# EAGLE schematic NewMUM (EAGLE 6.5.0)
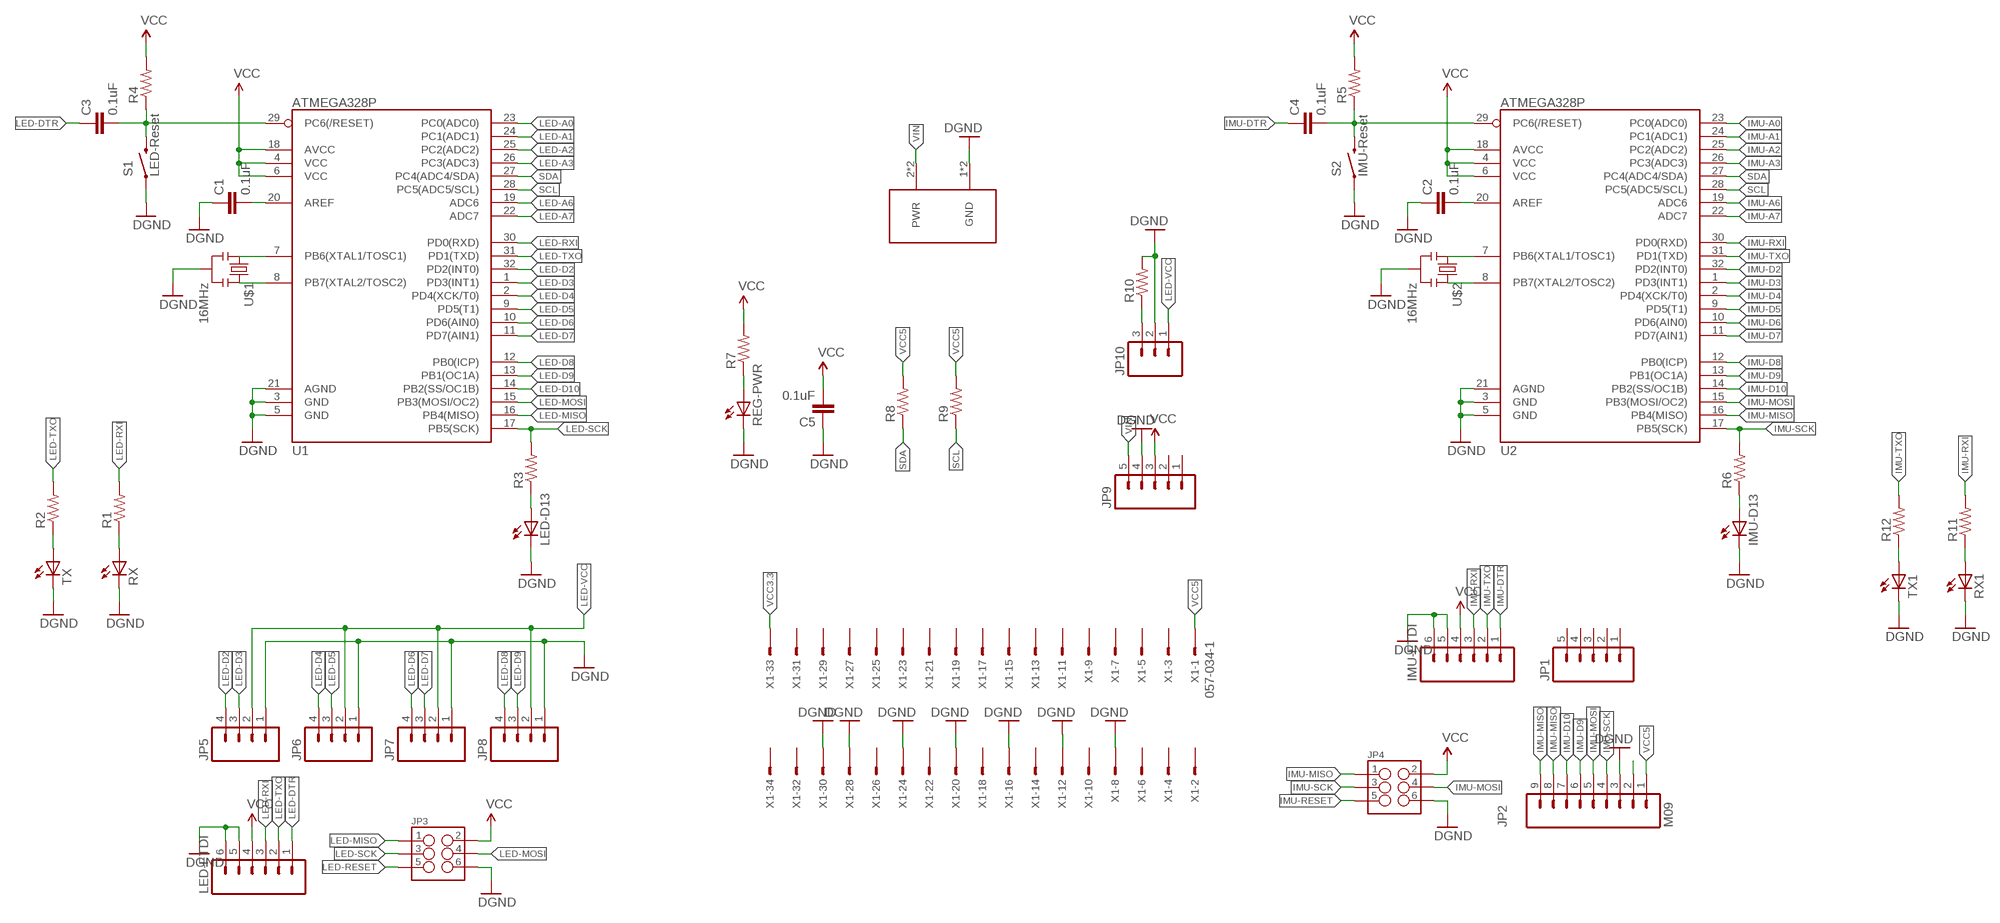
[diagram p0: schematic, sheet 1]

## Parts
C1  0.1uF  CAP0805  [0805]
C2  0.1uF  CAP0805  [0805]
C3  0.1uF  CAP0805  [0805]
C4  0.1uF  CAP0805  [0805]
C5  0.1uF  CAP0805  [0805]
IMU-D13  LED1206  [LED-1206]
IMU-FTDI  M06SIP  [1X06]
JP1  M05PTH  [1X05]
JP2  M09  [1X09]
JP3  M03X22X3_SILK_SM  [2X3]
JP4  M03X22X3_SILK_SM  [2X3]
JP5  M04PTH  [1X04]
JP6  M04PTH  [1X04]
JP7  M04PTH  [1X04]
JP8  M04PTH  [1X04]
JP9  M05PTH  [1X05]
JP10  M03PTH  [1X03]
LED-D13  LED1206  [LED-1206]
LED-FTDI  M06SIP  [1X06]
R1  RESISTOR0805-RES  [0805]
R2  RESISTOR0805-RES  [0805]
R3  RESISTOR0805-RES  [0805]
R4  RESISTOR0805-RES  [0805]
R5  RESISTOR0805-RES  [0805]
R6  RESISTOR0805-RES  [0805]
R7  RESISTOR0805-RES  [0805]
R8  RESISTOR0805-RES  [0805]
R9  RESISTOR0805-RES  [0805]
R10  RESISTOR0805-RES  [0805]
R11  RESISTOR0805-RES  [0805]
R12  RESISTOR0805-RES  [0805]
REG-PWR  LED1206  [LED-1206]
RX  LED1206  [LED-1206]
RX1  LED1206  [LED-1206]
S1  LED-Reset  SWITCH-MOMENTARY-2PTH  [TACTILE-PTH]
S2  IMU-Reset  SWITCH-MOMENTARY-2PTH  [TACTILE-PTH]
TX  LED1206  [LED-1206]
TX1  LED1206  [LED-1206]
U1  ATMEGA328P  ATMEGA328_SMT  [TQFP32-08]
U2  ATMEGA328P  ATMEGA328_SMT  [TQFP32-08]
U$1  16MHz  RESONATOR-WIDE  [RESONATOR-WIDE-SMD]
U$2  16MHz  RESONATOR-WIDE  [RESONATOR-WIDE-SMD]
U$3  LSF-SMT  [LSF-SMT]
X1  057-034-1  [057-034-1]

## Nets
GND: C1.1 C2.1 C5.1 IMU-D13.C IMU-FTDI.5 IMU-FTDI.6 JP2.3 JP3.6 JP4.6 JP5.1 JP6.1 JP7.1 JP8.1 JP9.4 JP10.2 LED-D13.C LED-FTDI.5 LED-FTDI.6 R10.2 REG-PWR.C RX1.C RX.C S1.1 S2.1 TX1.C TX.C U1.3(GND) U1.5(GND) U1.21(AGND) U2.3(GND) U2.5(GND) U2.21(AGND) U$1.2 U$2.2 U$3.1(GND) U$3.1-2(GND) X1.8 X1.12 X1.16 X1.20 X1.24 X1.28 X1.30 ; supply symbol labelled DGND
IMU-A0: U2.23(PC0(ADC0))
IMU-A1: U2.24(PC1(ADC1))
IMU-A2: U2.25(PC2(ADC2))
IMU-A3: U2.26(PC3(ADC3))
IMU-A6: U2.19(ADC6)
IMU-A7: U2.22(ADC7)
IMU-D2: U2.32(PD2(INT0))
IMU-D3: U2.1(PD3(INT1))
IMU-D4: U2.2(PD4(XCK/T0))
IMU-D5: U2.9(PD5(T1))
IMU-D6: U2.10(PD6(AIN0))
IMU-D7: U2.11(PD7(AIN1))
IMU-D8: U2.12(PB0(ICP))
IMU-D9: JP2.6 U2.13(PB1(OC1A))
IMU-D10: JP2.7 U2.14(PB2(SS/OC1B))
IMU-DTR: C4.1 IMU-FTDI.1
IMU-MISO: JP2.8 JP2.9 JP4.1 U2.16(PB4(MISO))
IMU-MOSI: JP2.5 JP4.4 U2.15(PB3(MOSI/OC2))
IMU-RESET: C4.2 JP4.5 R5.1 S2.3 U2.29(PC6(/RESET))
IMU-RXI: IMU-FTDI.3 R11.2 U2.30(PD0(RXD))
IMU-SCK: JP2.4 JP4.3 R6.2 U2.17(PB5(SCK))
IMU-TXO: IMU-FTDI.2 R12.2 U2.31(PD1(TXD))
LED-A0: U1.23(PC0(ADC0))
LED-A1: U1.24(PC1(ADC1))
LED-A2: U1.25(PC2(ADC2))
LED-A3: U1.26(PC3(ADC3))
LED-A6: U1.19(ADC6)
LED-A7: U1.22(ADC7)
LED-D2: JP5.4 U1.32(PD2(INT0))
LED-D3: JP5.3 U1.1(PD3(INT1))
LED-D4: JP6.4 U1.2(PD4(XCK/T0))
LED-D5: JP6.3 U1.9(PD5(T1))
LED-D6: JP7.4 U1.10(PD6(AIN0))
LED-D7: JP7.3 U1.11(PD7(AIN1))
LED-D8: JP8.4 U1.12(PB0(ICP))
LED-D9: JP8.3 U1.13(PB1(OC1A))
LED-D10: U1.14(PB2(SS/OC1B))
LED-DTR: C3.1 LED-FTDI.1
LED-MISO: JP3.1 U1.16(PB4(MISO))
LED-MOSI: JP3.4 U1.15(PB3(MOSI/OC2))
LED-RESET: C3.2 JP3.5 R4.1 S1.3 U1.29(PC6(/RESET))
LED-RXI: LED-FTDI.3 R1.2 U1.30(PD0(RXD))
LED-SCK: JP3.3 R3.2 U1.17(PB5(SCK))
LED-TXO: LED-FTDI.2 R2.2 U1.31(PD1(TXD))
LED-VCC: JP5.2 JP6.2 JP7.2 JP8.2 JP10.1
N$1: U2.8(PB7(XTAL2/TOSC2)) U$2.3
N$2: U2.7(PB6(XTAL1/TOSC1)) U$2.1
N$3: U1.8(PB7(XTAL2/TOSC2)) U$1.3
N$4: U1.7(PB6(XTAL1/TOSC1)) U$1.1
N$5: R1.1 RX.A
N$6: C1.2 U1.20(AREF)
N$7: C2.2 U2.20(AREF)
N$8: R2.1 TX.A
N$9: LED-D13.A R3.1
N$10: R11.1 RX1.A
N$11: IMU-D13.A R6.1
N$12: R12.1 TX1.A
N$13: JP2.2
N$14: R7.1 REG-PWR.A
N$17: JP10.3 R10.1
SCL: R9.1 U1.28(PC5(ADC5/SCL)) U2.28(PC5(ADC5/SCL))
SDA: R8.1 U1.27(PC4(ADC4/SDA)) U2.27(PC4(ADC4/SDA))
VCC: C5.2 IMU-FTDI.4 JP3.2 JP4.2 JP9.3 LED-FTDI.4 R4.2 R5.2 R7.2 U1.4(VCC) U1.6(VCC) U1.18(AVCC) U2.4(VCC) U2.6(VCC) U2.18(AVCC)
VCC3.3: X1.33
VCC5: JP2.1 R8.2 R9.2 X1.1
VIN: JP9.5 U$3.2(PWR) U$3.2-2(PWR)
Unconnected: JP1.1 JP1.2 JP1.3 JP1.4 JP1.5 JP9.1 JP9.2 X1.2 X1.3 X1.4 X1.5 X1.6 X1.7 X1.9 X1.10 X1.11 X1.13 X1.14 X1.15 X1.17 X1.18 X1.19 X1.21 X1.22 X1.23 X1.25 X1.26 X1.27 X1.29 X1.31 X1.32 X1.34

## Library data of the parts
C1-C5 = SparkFun-Capacitors:CAP: Capacitor Standard 0603 ceramic capacitor, and 0.1" leaded capacitor.
IMU-D13 LED-D13 REG-PWR RX RX1 TX TX1 = LilyPad-Wearables:LED: LEDs Standard schematic elements and footprints for 5mm, 3mm, 1206, and 0603 sized LEDs. 5mm - Spark Fun Electronics SKU : Comp-SBL
IMU-FTDI LED-FTDI = SparkFun-Connectors:M06: Header 6 Standard 6-pin 0.1" header. Use with straight break away headers (SKU : PRT-00116), right angle break away headers (PRT-00553), swiss pins (PRT-00743), machine pins (PRT-00117), and female headers (PRT-00115). Molex polarized connector foot print use with SKU : PRT-08094 with associated crimp pins and housings. NOTES ON THE VARIANTS LOCK and LOCK_LONGPADS... This footprint was designed to help hold the alignment of a through-hole component (i.e. 6-pin header) while soldering it into place. You may notice that each hole has been shifted either up or down by 0.005 of an inch from it's more standard position (which is a perfectly straight line). This slight alteration caused the pins (the squares in the middle) to touch the edges of the holes. Because they are alternating, it causes a "brace" to hold the component in place. 0.005 has proven to be the perfect amount of "off-center" position when using our standard breakaway headers. Although looks a little odd when you look at the bare footprint, once you have a header in there, the alteration is very hard to notice. Also,if you push a header all the way into place, it is covered up entirely on the bottom side. This idea of altering the position of holes to aid alignment will be further integrated into the Sparkfun Library for other footprints. It can help hold any component with 3 or more connection pins.
JP1 JP9 = SparkFun-Connectors:M05: Header 5 Standard 5-pin 0.1" header. Use with straight break away headers (SKU : PRT-00116), right angle break away headers (PRT-00553), swiss pins (PRT-00743), machine pins (PRT-00117), and female headers (PRT-00115). Molex polarized connector foot print use with SKU : PRT-08230 with associated crimp pins and housings.
JP2 = SparkFun-Connectors:M09: Header 9 Standard 9-pin 0.1" header. Use with straight break away headers (SKU : PRT-00116), right angle break away headers (PRT-00553), swiss pins (PRT-00743), machine pins (PRT-00117), and female headers (PRT-00115).
JP3 JP4 = SparkFun-Connectors:M03X2: 2x3 .1" header. Shrouded, with keying- CONN-10681 SMT- CONN-11415 Pogo pins- HW-11044
JP5-JP8 = SparkFun-Connectors:M04: Header 4 Standard 4-pin 0.1" header. Use with straight break away headers (SKU : PRT-00116), right angle break away headers (PRT-00553), swiss pins (PRT-00743), machine pins (PRT-00117), and female headers (PRT-00115). Molex polarized connector foot print use with SKU : PRT-08231 with associated crimp pins and housings. 1MM SMD Version SKU: PRT-10208
JP10 = SparkFun-Connectors:M03: Header 3 Standard 3-pin 0.1" header. Use with straight break away headers (SKU : PRT-00116), right angle break away headers (PRT-00553), swiss pins (PRT-00743), machine pins (PRT-00117), and female headers (PRT-00115). Molex polarized connector foot print use with SKU : PRT-08232 with associated crimp pins and housings.
R1-R12 = SparkFun-Passives:RESISTOR: Resistor Basic schematic elements and footprints for 0603, 1206, and PTH resistors.
S1 S2 = SparkFun-Electromechanical:SWITCH-MOMENTARY-2: Various NO switches- pushbuttons, reed, etc
U1 U2 = SparkFun-DigitalIC:ATMEGA328_SMT: 32-Pin Atmega328 part Commonly used on Arduino compatible boards Available in QFP and QFN packages TQFP is IC-09069 QFN is non-stock; PROD_ID: IC-09069
U$1 U$2 = SparkFun-FreqCtrl:RESONATOR-WIDE
U$3 = LSF-SMT:LSF-SMT
X1 = con-panduit:057-034-: CONNECTOR 34-pin series 057 contact pc board low profile headers; OC_FARNELL: unknown; OC_NEWARK: unknown